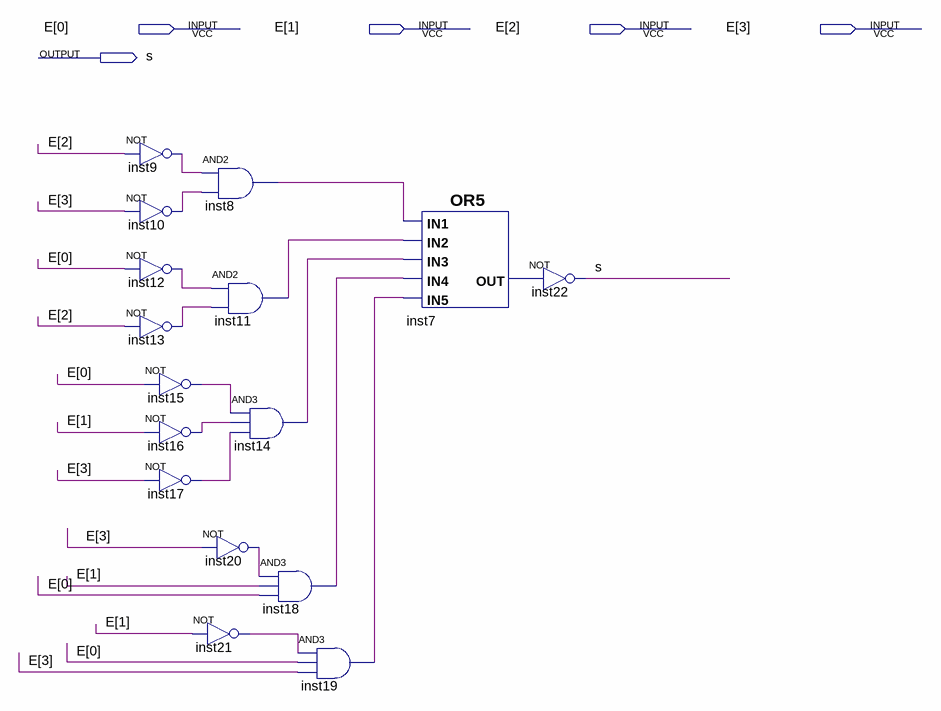
[diagram p0: schematic sheet]
// Quartus schematic B.bdf as structural Verilog: 16 symbols, 5 pins
module B (
  input  [3:0] E,
  output s
);

  wire inst7_out, inst8_out, inst9_out, inst10_out, inst11_out, inst12_out, inst13_out, inst14_out,
       inst15_out, inst16_out, inst17_out, inst18_out, inst19_out, inst20_out, inst21_out;

  not inst9 (inst9_out, E[2]);
  not inst10 (inst10_out, E[3]);
  not inst12 (inst12_out, E[0]);
  not inst13 (inst13_out, E[2]);
  and inst8 (inst8_out, inst9_out, inst10_out);
  and inst11 (inst11_out, inst12_out, inst13_out);
  not inst15 (inst15_out, E[0]);
  not inst16 (inst16_out, E[1]);
  not inst17 (inst17_out, E[3]);
  not inst20 (inst20_out, E[3]);
  not inst21 (inst21_out, E[1]);
  and inst14 (inst14_out, inst15_out, inst16_out, inst17_out);
  and inst18 (inst18_out, inst20_out, E[1], E[0]);
  and inst19 (inst19_out, inst21_out, E[0], E[3]);
  or inst7 (inst7_out, inst8_out, inst11_out, inst14_out, inst18_out, inst19_out);
  not inst22 (s, inst7_out);
endmodule
